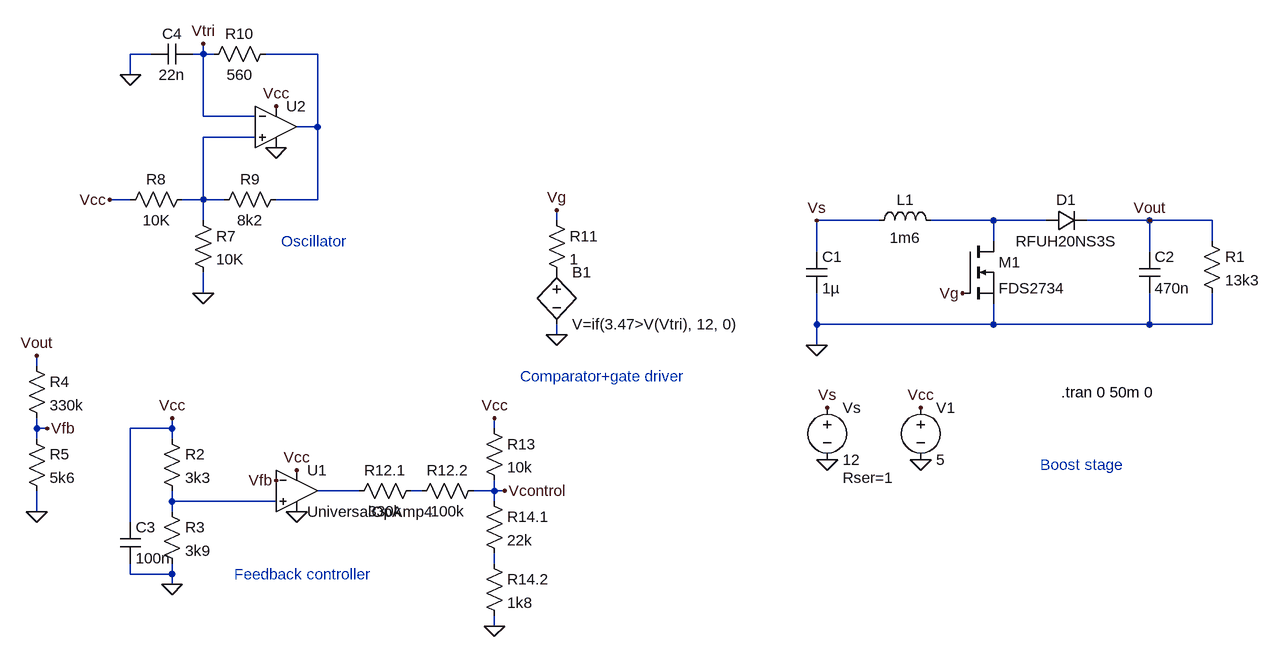
[diagram p0: schematic actual_boost_converter.asc]
actual_boost_converter.asc, the LTspice schematic file:
Version 4
SHEET 1 1336 804
WIRE -704 -112 -736 -112
WIRE -624 -112 -624 -128
WIRE -624 -112 -640 -112
WIRE -608 -112 -624 -112
WIRE -448 -112 -528 -112
WIRE -736 -80 -736 -112
WIRE -624 -16 -624 -112
WIRE -544 -16 -624 -16
WIRE -448 0 -448 -112
WIRE -448 0 -480 0
WIRE -544 16 -624 16
WIRE -736 112 -768 112
WIRE -624 112 -624 16
WIRE -624 112 -656 112
WIRE -592 112 -624 112
WIRE -448 112 -448 0
WIRE -448 112 -512 112
WIRE -624 144 -624 112
WIRE -80 144 -80 128
WIRE 416 144 320 144
WIRE 592 144 496 144
WIRE 672 144 592 144
WIRE 832 144 736 144
WIRE 928 144 832 144
WIRE 592 176 592 144
WIRE 928 176 928 144
WIRE 320 192 320 144
WIRE 832 192 832 144
WIRE -624 256 -624 224
WIRE 320 304 320 256
WIRE 592 304 592 272
WIRE 592 304 320 304
WIRE 832 304 832 256
WIRE 832 304 592 304
WIRE 928 304 928 256
WIRE 928 304 832 304
WIRE -80 320 -80 304
WIRE 320 336 320 304
WIRE -880 368 -880 352
WIRE -880 464 -880 448
WIRE -864 464 -880 464
WIRE -672 464 -672 448
WIRE -672 464 -736 464
WIRE -176 464 -176 448
WIRE -880 480 -880 464
WIRE -672 480 -672 464
WIRE -384 560 -448 560
WIRE -288 560 -304 560
WIRE -176 560 -176 544
WIRE -176 560 -208 560
WIRE -160 560 -176 560
WIRE -672 576 -672 560
WIRE -512 576 -672 576
WIRE -176 576 -176 560
WIRE -880 592 -880 560
WIRE -672 592 -672 576
WIRE -736 608 -736 464
WIRE -176 672 -176 656
WIRE -736 688 -736 672
WIRE -672 688 -672 672
WIRE -672 688 -736 688
WIRE -672 704 -672 688
WIRE -176 768 -176 752
FLAG 336 512 0
FLAG 336 432 Vs
FLAG 832 144 Vout
FLAG 320 144 Vs
FLAG 320 336 0
FLAG -672 704 0
FLAG -672 448 Vcc
FLAG -512 544 Vfb
FLAG -880 352 Vout
FLAG -864 464 Vfb
FLAG 480 432 Vcc
FLAG 480 512 0
FLAG -480 528 Vcc
FLAG -480 592 0
FLAG -624 256 0
FLAG -512 -32 Vcc
FLAG -512 32 0
FLAG -736 -80 0
FLAG -768 112 Vcc
FLAG -624 -128 Vtri
FLAG -160 560 Vcontrol
FLAG -80 128 Vg
FLAG 544 256 Vg
FLAG -80 320 0
FLAG -176 448 Vcc
FLAG -880 592 0
FLAG -176 768 0
SYMBOL ind 400 160 R270
WINDOW 0 32 56 VTop 2
WINDOW 3 5 56 VBottom 2
SYMATTR InstName L1
SYMATTR Value 1m6
SYMBOL nmos 544 176 R0
SYMATTR InstName M1
SYMATTR Value FDS2734
SYMBOL diode 672 160 R270
WINDOW 0 32 32 VTop 2
WINDOW 3 0 32 VBottom 2
SYMATTR InstName D1
SYMATTR Value RFUH20NS3S
SYMBOL cap 304 192 R0
SYMATTR InstName C1
SYMATTR Value 1µ
SYMBOL cap 816 192 R0
SYMATTR InstName C2
SYMATTR Value 470n
SYMBOL voltage 336 416 R0
WINDOW 123 0 0 Left 0
WINDOW 39 24 124 Left 2
SYMATTR SpiceLine Rser=1
SYMATTR InstName Vs
SYMATTR Value 12
SYMBOL res 912 160 R0
SYMATTR InstName R1
SYMATTR Value 13k3
SYMBOL OpAmps\\UniversalOpAmp4 -480 560 R0
SYMATTR InstName U1
SYMBOL res -688 464 R0
SYMATTR InstName R2
SYMATTR Value 3k3
SYMBOL res -688 576 R0
SYMATTR InstName R3
SYMATTR Value 3k9
SYMBOL res -896 352 R0
SYMATTR InstName R4
SYMATTR Value 330k
SYMBOL res -896 464 R0
SYMATTR InstName R5
SYMATTR Value 5k6
SYMBOL cap -752 608 R0
SYMATTR InstName C3
SYMATTR Value 100n
SYMBOL voltage 480 416 R0
WINDOW 123 0 0 Left 0
WINDOW 39 0 0 Left 0
SYMATTR InstName V1
SYMATTR Value 5
SYMBOL res -640 128 R0
SYMATTR InstName R7
SYMATTR Value 10K
SYMBOL res -640 96 R90
WINDOW 0 0 56 VBottom 2
WINDOW 3 32 56 VTop 2
SYMATTR InstName R8
SYMATTR Value 10K
SYMBOL res -496 96 R90
WINDOW 0 0 56 VBottom 2
WINDOW 3 32 56 VTop 2
SYMATTR InstName R9
SYMATTR Value 8k2
SYMBOL res -512 -128 R90
WINDOW 0 0 56 VBottom 2
WINDOW 3 32 56 VTop 2
SYMATTR InstName R10
SYMATTR Value 560
SYMBOL cap -640 -128 R90
WINDOW 0 0 32 VBottom 2
WINDOW 3 32 32 VTop 2
SYMATTR InstName C4
SYMATTR Value 22n
SYMBOL OpAmps\\UniversalOpAmp2 -512 0 R0
SYMATTR InstName U2
SYMBOL bv -80 208 R0
SYMATTR InstName B1
SYMATTR Value V=if(3.47>V(Vtri), 12, 0)
SYMBOL res -96 128 R0
SYMATTR InstName R11
SYMATTR Value 1
SYMBOL res -288 544 R90
WINDOW 0 0 56 VBottom 2
WINDOW 3 32 56 VTop 2
SYMATTR InstName R12.1
SYMATTR Value 330k
SYMBOL res -192 448 R0
SYMATTR InstName R13
SYMATTR Value 10k
SYMBOL res -192 560 R0
SYMATTR InstName R14.1
SYMATTR Value 22k
SYMBOL res -192 656 R0
SYMATTR InstName R14.2
SYMATTR Value 1k8
SYMBOL res -192 544 R90
WINDOW 0 0 56 VBottom 2
WINDOW 3 32 56 VTop 2
SYMATTR InstName R12.2
SYMATTR Value 100k
TEXT 696 408 Left 2 !.tran 0 50m 0
TEXT -136 384 Left 2 ;Comparator+gate driver
TEXT 664 520 Left 2 ;Boost stage
TEXT -576 688 Left 2 ;Feedback controller
TEXT -504 176 Left 2 ;Oscillator

The netlist it stands for:
* actual_boost_converter.asc
L1 Vs N003 1m6
M1 N003 Vg 0 0 FDS2734
D1 N003 Vout RFUH20NS3S
C1 Vs 0 1µ
C2 Vout 0 470n
Vs Vs 0 12 Rser=1
R1 Vout 0 13k3
* U1: UniversalOpAmp4 (symbol OpAmps\UniversalOpAmp4 not available, pins judged from their places): In+=N006 In-=Vfb V+=Vcc V-=0 OUT=N004
R2 Vcc N006 3k3
R3 N006 0 3k9
R4 Vout Vfb 330k
R5 Vfb 0 5k6
C3 Vcc 0 100n
V1 Vcc 0 5
R7 N002 0 10K
R8 N002 Vcc 10K
R9 N001 N002 8k2
R10 N001 Vtri 560
C4 Vtri 0 22n
XU2 N002 Vtri Vcc 0 N001 level2 Avol=1Meg GBW=10Meg Slew=10Meg Ilimit=25m Rail=0 Vos=0 En=0 Enk=0 In=0 Ink=0 Rin=500Meg  ; pins In+ In- V+ V- OUT
B1 P001 0 V=if(3.47>V(Vtri), 12, 0)
R11 Vg P001 1
R12.1 N005 N004 330k
R13 Vcc Vcontrol 10k
R14.1 Vcontrol N007 22k
R14.2 N007 0 1k8
R12.2 Vcontrol N005 100k
.model D D
.lib standard.dio
.model NMOS NMOS
.model PMOS PMOS
.lib standard.mos
.tran 0 50m 0
* Comparator+gate driver
* Boost stage
* Feedback controller
* Oscillator
.lib UniversalOpAmp2.lib
.backanno
.end